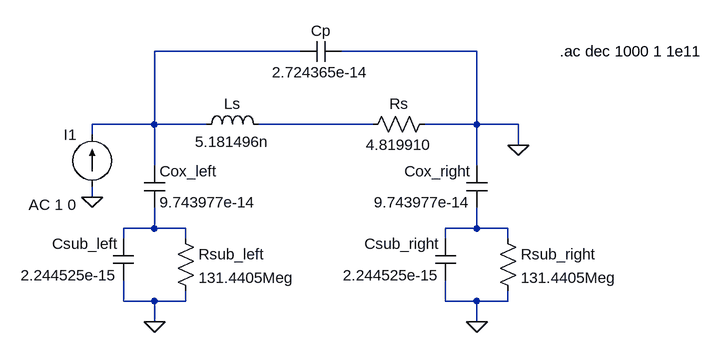
[diagram p0: schematic Project3_testCircuit.asc]
Project3_testCircuit.asc, the LTspice schematic file:
Version 4
SHEET 1 952 680
WIRE 288 16 64 16
WIRE 560 16 352 16
WIRE 64 128 64 16
WIRE 64 128 -32 128
WIRE 144 128 64 128
WIRE 400 128 224 128
WIRE 560 128 560 16
WIRE 560 128 480 128
WIRE 624 128 560 128
WIRE -32 144 -32 128
WIRE 624 160 624 128
WIRE 64 192 64 128
WIRE 560 192 560 128
WIRE -32 240 -32 224
WIRE 64 288 64 256
WIRE 64 288 16 288
WIRE 112 288 64 288
WIRE 560 288 560 256
WIRE 560 288 512 288
WIRE 608 288 560 288
WIRE 16 304 16 288
WIRE 112 304 112 288
WIRE 512 304 512 288
WIRE 608 304 608 288
WIRE 16 400 16 368
WIRE 64 400 16 400
WIRE 112 400 112 384
WIRE 112 400 64 400
WIRE 512 400 512 368
WIRE 560 400 512 400
WIRE 608 400 608 384
WIRE 608 400 560 400
WIRE 64 432 64 400
WIRE 560 432 560 400
FLAG 560 432 0
FLAG 64 432 0
FLAG -32 240 0
FLAG 624 160 0
SYMBOL cap 352 0 R90
WINDOW 0 0 32 VBottom 2
WINDOW 3 32 32 VTop 2
SYMATTR InstName Cp
SYMATTR Value 2.724365e-14
SYMBOL ind 128 144 R270
WINDOW 0 32 56 VTop 2
WINDOW 3 5 56 VBottom 2
SYMATTR InstName Ls
SYMATTR Value 5.181496n
SYMBOL res 496 112 R90
WINDOW 0 0 56 VBottom 2
WINDOW 3 32 56 VTop 2
SYMATTR InstName Rs
SYMATTR Value 4.819910
SYMBOL cap 576 192 M0
SYMATTR InstName Cox_right
SYMATTR Value 9.743977e-14
SYMBOL cap 48 192 R0
SYMATTR InstName Cox_left
SYMATTR Value 9.743977e-14
SYMBOL cap 32 304 M0
SYMATTR InstName Csub_left
SYMATTR Value 2.244525e-15
SYMBOL cap 528 304 M0
SYMATTR InstName Csub_right
SYMATTR Value 2.244525e-15
SYMBOL res 96 288 R0
SYMATTR InstName Rsub_left
SYMATTR Value 131.4405Meg
SYMBOL res 592 288 R0
SYMATTR InstName Rsub_right
SYMATTR Value 131.4405Meg
SYMBOL current -32 224 R180
WINDOW 0 24 80 Left 2
WINDOW 3 24 -56 Left 2
WINDOW 123 24 -28 Left 2
WINDOW 39 0 0 Left 0
SYMATTR InstName I1
SYMATTR Value ""
SYMATTR Value2 AC 1 0
TEXT 688 16 Left 2 !.ac dec 1000 1 1e11

The netlist it stands for:
* Project3_testCircuit.asc
Cp 0 N001 2.724365e-14
Ls N001 N002 5.181496n
Rs 0 N002 4.819910
Cox_right 0 N004 9.743977e-14
Cox_left N001 N003 9.743977e-14
Csub_left N003 0 2.244525e-15
Csub_right N004 0 2.244525e-15
Rsub_left N003 0 131.4405Meg
Rsub_right N004 0 131.4405Meg
I1 0 N001 AC 1 0
.ac dec 1000 1 1e11
.backanno
.end